# Altium schematic sheet POWER.SchDoc
size A
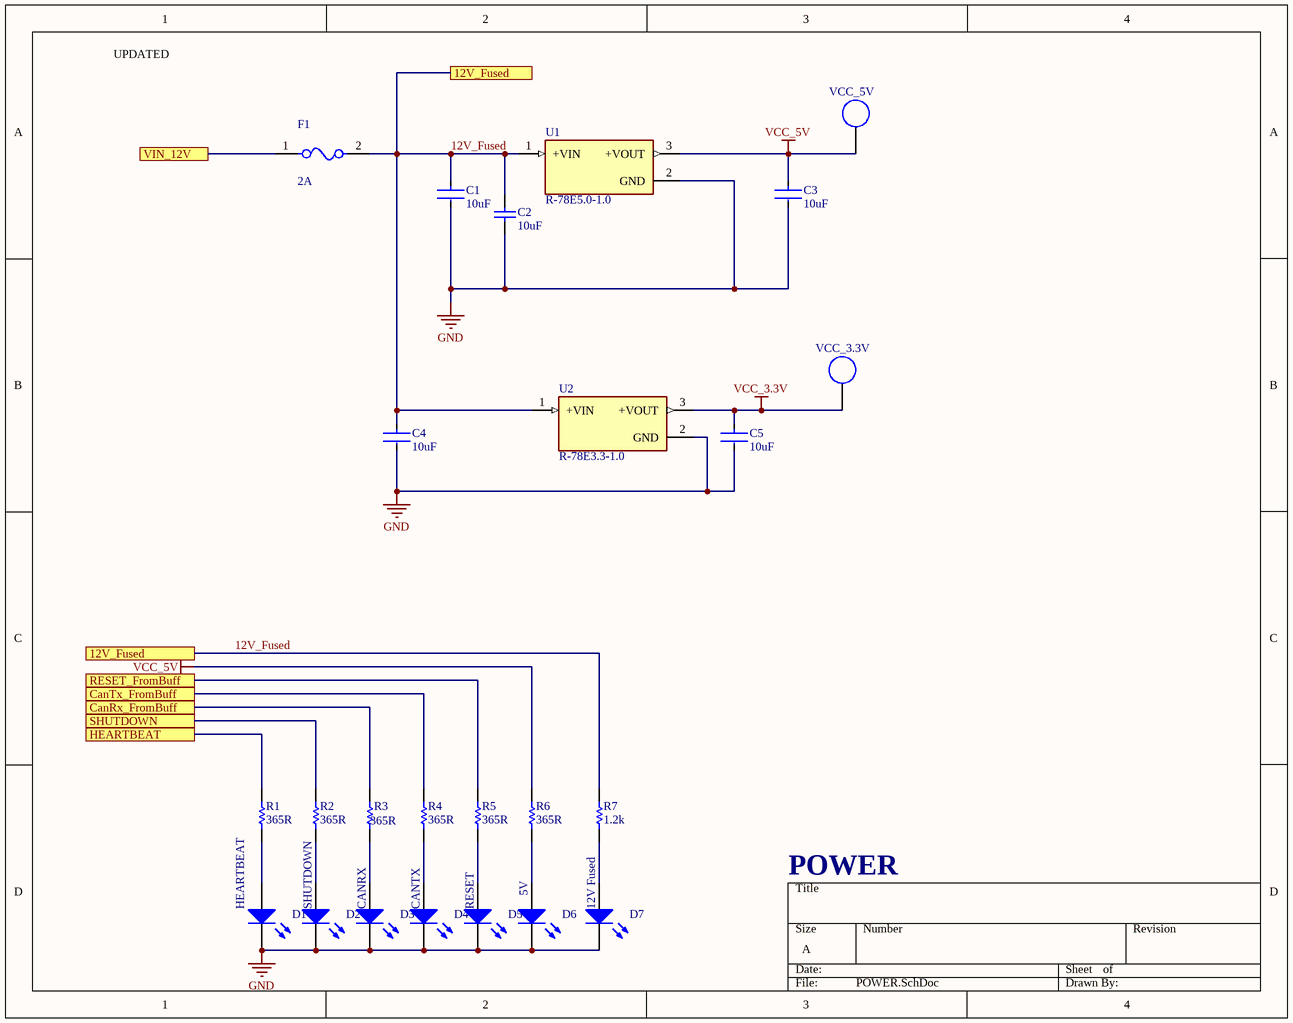
[diagram p0: POWER.SchDoc]

## Parts
C1  10uF  [FP-C2012-125-0_2-MFG]
C2  10uF  [CAPPRD200W50D550H1250]
C3  10uF  [FP-C2012-125-0_2-MFG]
C4  10uF  [FP-C2012-125-0_2-MFG]
C5  10uF  [FP-C2012-125-0_2-MFG]
D1  HEARTBEAT  [0805_A]
D2  SHUTDOWN  [0805_A]
D3  CANRX  [0805_A]
D4  CANTX  [0805_A]
D5  RESET  [0805_A]
D6  5V  [0805_A]
D7  12V Fused  [0805_A]
F1  2A  [FP-0154-MFG]
R1  365R  [RESC2013X60X35ML10T20]
R2  365R  [RESC2013X60X35ML10T20]
R3  365R  [RESC2013X60X35ML10T20]
R4  365R  [RESC2013X60X35ML10T20]
R5  365R  [RESC2013X60X35ML10T20]
R6  365R  [RESC2013X60X35ML10T20]
R7  1.2k  [RESC2013X60X35ML10T20]
U1  R-78E5.0-1.0  [CONV_R-78E5.0-1.0]
U2  R-78E3.3-1.0  [CONV_R-78E3.3-1.0]
VCC_3.3V  5015  [5015]  (value not drawn)
VCC_5V  5015  [5015]  (value not drawn)

## Ports
12V_Fused, CanRx_FromBuff, CanTx_FromBuff, HEARTBEAT, RESET_FromBuff, SHUTDOWN, VIN_12V

## Nets
GND: C1.2 C2.2(Neg) C3.2 C4.2 C5.2 D1.1(K) D2.1(K) D3.1(K) D4.1(K) D5.1(K) D6.1(K) D7.1(K) U1.2(GND) U2.2(GND)
VCC_3.3V: C5.1 U2.3(+VOUT) VCC_3.3V.1
VCC_5V: C3.1 R6.2 U1.3(+VOUT) VCC_5V.1
12V_Fused: C1.1 C2.1(Pos) C4.1 F1.2 R7.2 U1.1(+VIN) U2.1(+VIN) ; port 12V_Fused
CanRx_FromBuff: R3.2 ; port CanRx_FromBuff
CanTx_FromBuff: R4.2 ; port CanTx_FromBuff
HEARTBEAT: R1.2 ; port HEARTBEAT
RESET_FromBuff: R5.2 ; port RESET_FromBuff
SHUTDOWN: R2.2 ; port SHUTDOWN
VIN_12V: F1.1 ; port VIN_12V
NetD1_2: D1.2(A) R1.1
NetD2_2: D2.2(A) R2.1
NetD3_2: D3.2(A) R3.1
NetD4_2: D4.2(A) R4.1
NetD5_2: D5.2(A) R5.1
NetD6_2: D6.2(A) R6.1
NetD7_2: D7.2(A) R7.1

## Notes on the sheet
- (near F1) UPDATED
- POWER

## Library data of the parts
C1 C3-C5 = CMP-08246-003655-1: Multilayer Ceramic Capacitors 10μF ±10% 16V X6S SMD 0805; Contact Plating: Tin; Height: 1.25mm; Thickness: 0.057inch; Case Code (Metric): 2012; Dielectric Material: Ceramic; Tolerance: 10%; Depth: 1.25mm; Length: 2mm; Lead Free: Lead Free; RoHS Compliant: Yes; Case/Package: 0805; REACH SVHC: No SVHC; Capacitance: 10uF; Construction: Flat; Voltage Rating: 16V; Max Operating Temperature: 105°C; Series: C; Width: 0.049inch; Voltage Rating (DC): 16V; Packaging: Tape and Reel; Package Quantity: 1; Min Operating Temperature: -55°C; Mount: Surface Mount; Dielectric: X6S; Case Code (Imperial): 0805; Supplier 1: Digi-Key; Supplier Part Number 1: 445-7611-1-ND
C2 = Cap, TH, Electrolytic_5mm: Cap Alum 10UF 20% 25V Radial; Manufacturer 1: KEMET; Manufacturer Part Number 1: ESW106M025AC3AA; TargetLibrary: RITRacing-Passives; Value: Value?; Publisher: T.Tallo; Published: 22Oct2016; Status: Active; Supplier 1: Digi-Key; Supplier Part Number 1: 399-ESW106M025AC3AA-ND; Stock 1: 7476; Pricing 1: 1=0.23000, 10=0.15400, 50=0.09260, 100=0.07820, 500=0.05352, 1000=0.04735, 2500=0.04529, 5000=0.04117 (USD); RoHS Compliant: Yes
D1-D7 = CMP-1426-00009-1: SMD mono-color Chip LED, WL-SMCW, Bright Green; PartNumber: 150080VS75000; Manufacturer: Wuerth Elektronik; Manufacturer 1: Wurth Electronics; Luminous Intensity: 40mcd; Forward Current: 30mA; Forward Voltage: 2V; Viewing Angle: 140°; Wavelength: 570nm; Lens Style: Clear,Rectangular; Test Current: 20mA; ComponentLink1Description: Manufacturer URL; Color: Bright Green; PackageReference: 0805_A; ComponentLink1URL: http://www.we-online.com; ComponentLink2Description: Datasheet; ComponentLink2URL: http://katalog.we-online.com/led/datasheet/150080VS75000.pdf; Supplier 1: Digi-Key; Supplier Part Number 1: 732-4986-1-ND; Manufacturer Part Number 1: 150080VS75000; RoHS: Yes; Category: LEDs; Stock 1: 20997; Pricing 1: 1=0.18000, 50=0.16500, 100=0.14200, 500=0.12300 (USD); Mount: Surface Mount; Case/Package: 0805; Case Code (Metric): 2012; Case Code (Imperial): 0805; Min Operating Temperature: -40°C; Max Operating Temperature: 85°C; Package Quantity: 4000; Packaging: Tape and Reel; Dominant Wavelength: 570nm; Length: 2mm; Width: 1.25mm; Height: 0.7mm; REACH SVHC: Unknown; ComponentLink3URL: https://datasheet.ciiva.com/22656/150080vs75000-22656966.pdf?src-supplier=Element14; ComponentLink3Description: https://datasheet.ciiva.com/22656/150080vs75000-22656966.pdf?src-supplier=Element14; ComponentLink4URL: https://datasheet.ciiva.com/29279/759437-da-01-en-chipled-0805-w-kl-h-gruen-150080vs7500-29279047.pdf?src-supplier=Conrad; ComponentLink4Description: https://datasheet.ciiva.com/29279/759437-da-01-en-chipled-0805-w-kl-h-gruen-150080vs7500-29279047.pdf?src-supplier=Conrad; ComponentLink5URL: https://datasheet.ciiva.com/29563/150080vs75000-29563018.pdf?src-supplier=Digi-Key; ComponentLink5Description: https://datasheet.ciiva.com/29563/150080vs75000-29563018.pdf?src-supplier=Digi-Key
F1 = CMP-08605-000033-1: FUSE BOARD MNT 2A 125VAC/VDC SMD; Manufacturer Part Number: 0154002.DR; Manufacturer: Littelfuse; Fuse I2T: 8.2A2Sec; Voltage Rating: 125V; Value: 0.0625Ω; Fuse Blow Speed: Fast; ComponentLink2URL: https://www.littelfuse.com/~/media/electronics/datasheets/fuses/littelfuse_fuse_154_154t_154l_154tl_datasheet.pdf.pdf; Digikey Description: FUSE BOARD MNT 2A 125VAC/VDC SMD; Temperature Range Low: -55°C; Mouser Description: 154 Series Fast-Acting 125 V 2 A 9.73 x 5.03 mm OMNI-BLOK® SMT Fuse & Holder; Device Class L1: Circuit Protection; Temperature: -55°C to +125°C; Automotive: No; ComponentLink2Description: Datasheet; Device Class L3: unset; Octopart: https://octopart.com/0154002.dr-littelfuse-565858; Height: 3.81mm; Fuse Current: 2A; Temperature Range High: +125°C; RoHS: TRUE; Max Fuse Ac Voltage: 125V; Category: Fuse; Package: 0154; Lead Free: Yes; Device Class L2: Fuses; Max Fuse Dc Voltage: 125V; Resistance: 0.0625Ω; Supplier 1: Digi-Key; Supplier Part Number 1: F1224CT-ND
R1-R6 = CMP-2001-01100-1: Part Number: RC0805FR-07365RL; Manufacturer: Yageo
R7 = CMP-2001-00959-1: Part Number: RC0805FR-071K24L; Manufacturer: Yageo
U1 = R-78E5.0-1.0: 1A DC/DC-Converter 'INNOLINE' SIP3 reg; MF: Recom Power; Price: None; Availability: Unavailable; SnapEDA_Link: https://www.snapeda.com/parts/R-78E5.0-1.0/Recom%20Power/view-part/557753/?ref=snap; Value: *; Package: SIP-3 Recom Power; MP: R-78E5.0-1.0; Supplier 1: Digi-Key; Supplier Part Number 1: 945-2201-ND
U2 = R-78E3.3-1.0: 1A DC/DC-Converter 'INNOLINE' SIP3 reg; MF: Recom Power; Package: SIP-3 Recom Power; Digi-Key_Part_Number: 945-2409-5-ND; SnapEDA_Link: https://www.snapeda.com/parts/R-78E3.3-0.5/Recom%20Power/view-part/229066/?ref=snap; Digi-Key_Purchase_URL: https://www.digikey.com/en/products/detail/recom-power/R-78E3-3-1-0/5327711; Value: *; MP: R-78E3.3-1.0; Supplier 1: Digi-Key; Supplier Part Number 1: 945-2409-5-ND
VCC_3.3V VCC_5V = 5015: SMD Test Point; Manufacturer: Keystone Electronics; TargetLibrary: RITRacing-Connectors; PartNumber: 5015; Publisher: T.Tallo; Published: 22Oct2016; Status: Active; ComponentLink1URL: http://www.mouser.com/ds/2/215/005-5009-743680.pdf; ComponentLink1Description: Datasheet